# Altium project 08-placa-integradora.PrjPcb
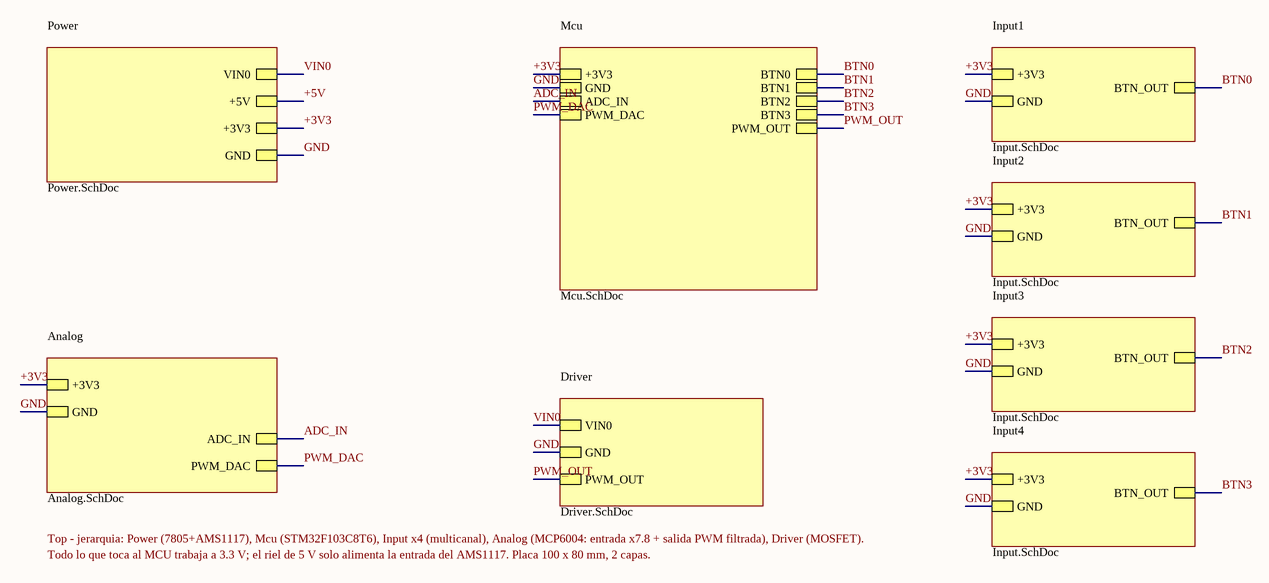
[diagram p0: Top.SchDoc]
6 sheets, 95 parts. Net scope: hierarchical (ports join the sheet entries above them; power ports are global).
Board file: PCB8.PcbDoc
Sheets:
  Top.SchDoc
    Power = Power.SchDoc
    Mcu = Mcu.SchDoc
    Input1 = Input.SchDoc
    Input2 = Input.SchDoc
    Input3 = Input.SchDoc
    Input4 = Input.SchDoc
    Analog = Analog.SchDoc
    Driver = Driver.SchDoc

## Sheet Top.SchDoc: Top: placa de entrenamiento integradora 100 x 80 mm (ejemplo 08)
size A4; Author: Efrain Alvarado; CompanyName: Universidad de Cuenca - MCIE; DrawnBy: Efrain Alvarado; DocumentNumber: E08-T; Revision: 1.0; SheetNumber: 1; SheetTotal: 6

### Sub-sheets
Analog = Analog.SchDoc: +3V3, GND, ADC_IN, PWM_DAC
Driver = Driver.SchDoc: VIN0, GND, PWM_OUT
Input1 = Input.SchDoc: +3V3, GND, BTN_OUT
Input2 = Input.SchDoc: +3V3, GND, BTN_OUT
Input3 = Input.SchDoc: +3V3, GND, BTN_OUT
Input4 = Input.SchDoc: +3V3, GND, BTN_OUT
Mcu = Mcu.SchDoc: +3V3, GND, ADC_IN, PWM_DAC, BTN0, BTN1, BTN2, BTN3, PWM_OUT
Power = Power.SchDoc: VIN0, +5V, +3V3, GND

### Nets
+3V3: sheet Power/+3V3, sheet Mcu/+3V3, sheet Input1/+3V3, sheet Input2/+3V3, sheet Input3/+3V3, sheet Input4/+3V3, sheet Analog/+3V3
ADC_IN: sheet Mcu/ADC_IN, sheet Analog/ADC_IN
BTN0: sheet Mcu/BTN0, sheet Input1/BTN_OUT
BTN1: sheet Mcu/BTN1, sheet Input2/BTN_OUT
BTN2: sheet Mcu/BTN2, sheet Input3/BTN_OUT
BTN3: sheet Mcu/BTN3, sheet Input4/BTN_OUT
GND: sheet Power/GND, sheet Mcu/GND, sheet Input1/GND, sheet Input2/GND, sheet Input3/GND, sheet Input4/GND, sheet Analog/GND, sheet Driver/GND
PWM_DAC: sheet Mcu/PWM_DAC, sheet Analog/PWM_DAC
PWM_OUT: sheet Mcu/PWM_OUT, sheet Driver/PWM_OUT
VIN0: sheet Power/VIN0, sheet Driver/VIN0

### Notes on the sheet
- Top - jerarquia: Power (7805+AMS1117), Mcu (STM32F103C8T6), Input x4 (multicanal), Analog (MCP6004: entrada x7.8 + salida PWM filtrada), Driver (MOSFET).
- Todo lo que toca al MCU trabaja a 3.3 V; el riel de 5 V solo alimenta la entrada del AMS1117. Placa 100 x 80 mm, 2 capas.

## Sheet Power.SchDoc: Power: 7805 + AMS1117-3.3 en cascada (ejemplo 08)
size A4; Author: Efrain Alvarado; CompanyName: Universidad de Cuenca - MCIE; DrawnBy: Efrain Alvarado; DocumentNumber: E08-P; Revision: 1.0; SheetNumber: 1; SheetTotal: 1
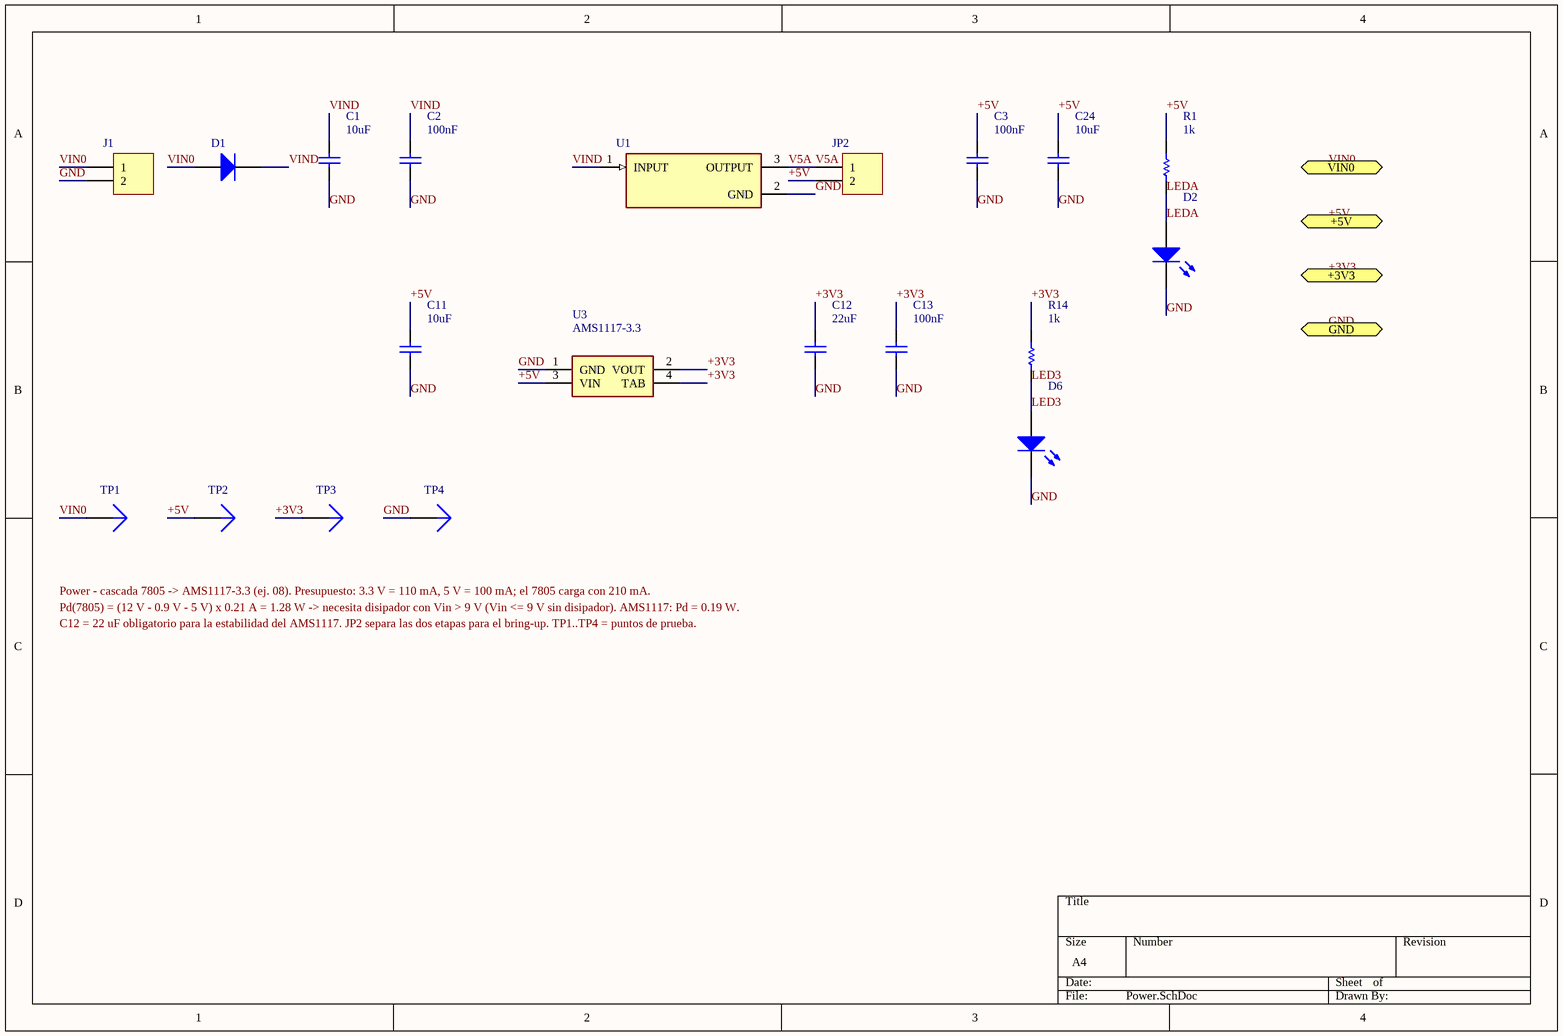
[diagram p1: Power.SchDoc]

### Parts
C1  value 10uF  [C0805]  (hidden comment: Cap)
C2  value 100nF  [0603]  (hidden comment: Cap)
C3  value 100nF  [0603]  (hidden comment: Cap)
C11  value 10uF  [C0805]  (hidden comment: Cap)
C12  value 22uF  [C1206]  (hidden comment: Cap)
C13  value 100nF  [0603]  (hidden comment: Cap)
C24  value 10uF  [C0805]  (hidden comment: Cap)
D1  Diode 1N4007  [DO-41]  (value not drawn)
D2  LED1  [LED-1]  (value not drawn)
D6  LED1  [LED-1]  (value not drawn)
J1  Header 2  [HDR1X2]  (value not drawn)
JP2  Header 2  [HDR1X2]  (value not drawn)
R1  value 1k  [0603]  (hidden comment: Res1)
R14  value 1k  [0603]  (hidden comment: Res1)
TP1  Plug  [PIN1]  (value not drawn)
TP2  Plug  [PIN1]  (value not drawn)
TP3  Plug  [PIN1]  (value not drawn)
TP4  Plug  [PIN1]  (value not drawn)
U1  LM7805T  [TO254P1011X457X1950-3]  (value not drawn)
U3  AMS1117-3.3  [SOT223_N]

### Ports
+3V3, +5V, GND, VIN0

### Nets
+3V3: C12.2 C13.2 R14.2 TP3.1 U3.2(VOUT) U3.4(TAB) ; port +3V3
+5V: C3.2 C11.2 C24.2 JP2.2 R1.2 TP2.1 U3.3(VIN) ; port +5V
GND: C1.1 C2.1 C3.1 C11.1 C12.1 C13.1 C24.1 D2.2(K) D6.2(K) J1.2 TP4.1 U1.2(GND) U3.1(GND) ; port GND
LED3: D6.1(A) R14.1
LEDA: D2.1(A) R1.1
V5A: JP2.1 U1.3(OUTPUT)
VIN0: D1.1(A) J1.1 TP1.1 ; port VIN0
VIND: C1.2 C2.2 D1.2(K) U1.1(INPUT)

### Notes on the sheet
- Power - cascada 7805 -> AMS1117-3.3 (ej. 08). Presupuesto: 3.3 V = 110 mA, 5 V = 100 mA; el 7805 carga con 210 mA.
- Pd(7805) = (12 V - 0.9 V - 5 V) x 0.21 A = 1.28 W -> necesita disipador con Vin > 9 V (Vin <= 9 V sin disipador). AMS1117: Pd = 0.19 W.
- C12 = 22 uF obligatorio para la estabilidad del AMS1117. JP2 separa las dos etapas para el bring-up. TP1..TP4 = puntos de prueba.

### Library data of the parts
C1 C11 C24 = Cap: Capacitor 10uF; Manufacturer: KEMET; Manufacturer Part Number: C0805C10610uF; Published: 8-Jun-2000; LatestRevisionDate: 17-Jul-2002; LatestRevisionNote: Re-released for DXP Platform.; PackageReference: RAD-0.3; Publisher: Altium Limited; PackageDescription: Radial Cap, Thru-Hole; 2 Leads; 0.3 in Pin Spacing
C2 C3 C13 = Cap: Capacitor 100nF; Manufacturer: KEMET; Manufacturer Part Number: C0603C100nF; Published: 8-Jun-2000; LatestRevisionDate: 17-Jul-2002; LatestRevisionNote: Re-released for DXP Platform.; PackageReference: RAD-0.3; Publisher: Altium Limited; PackageDescription: Radial Cap, Thru-Hole; 2 Leads; 0.3 in Pin Spacing
C12 = Cap: Capacitor 22uF; Manufacturer: KEMET; Manufacturer Part Number: C1206C22622uF; Published: 8-Jun-2000; LatestRevisionDate: 17-Jul-2002; LatestRevisionNote: Re-released for DXP Platform.; PackageReference: RAD-0.3; Publisher: Altium Limited; PackageDescription: Radial Cap, Thru-Hole; 2 Leads; 0.3 in Pin Spacing
D1 = Diode 1N4007: Proteccion de polaridad inversa; Manufacturer: Diodes Inc.; Published: 8-Jun-2000; LatestRevisionDate: 17-Jul-2002; LatestRevisionNote: Re-released for DXP Platform.; DatasheetVersion: 1998; PackageVersion: Aug-1999; PackageReference: DO-41; Publisher: Altium Limited; PackageDescription: Diode, Axial; Body 5.2 x 2.7 mm (LxDia. max), Lead Dia. 0.86 mm (max); Code_JEDEC: DO-204-AL; ComponentLink1Description: Manufacturer Link; ComponentLink1URL: http://www.fairchildsemi.com/; ComponentLink2Description: Datasheet; ComponentLink2URL: http://www.fairchildsemi.com/ds/1N%2F1N4001.pdf; Manufacturer Part Number: 1N4007
D2 = LED1: LED de alimentacion (5 V); Manufacturer: Kingbright; Manufacturer Part Number: WP7113ID; Published: 8-Jun-2000; LatestRevisionDate: 08-Jul-2005; LatestRevisionNote: Mech Layer 1 removed.; PackageReference: LED-1; Publisher: Altium Limited; PackageDescription: LED; 2 Leads
D6 = LED1: LED de alimentacion (3.3 V); Manufacturer: Kingbright; Manufacturer Part Number: WP7113GD; Published: 8-Jun-2000; LatestRevisionDate: 08-Jul-2005; LatestRevisionNote: Mech Layer 1 removed.; PackageReference: LED-1; Publisher: Altium Limited; PackageDescription: LED; 2 Leads
J1 = Header 2: Entrada 9-12 V DC: pin1 VIN, pin2 GND; Manufacturer: Generic; Manufacturer Part Number: Pin header 1x2 / borne; LatestRevisionDate: 17-Jul-2002; LatestRevisionNote: Re-released for DXP Platform.; Publisher: Altium Limited
JP2 = Header 2: Jumper de separacion entre etapas; Manufacturer: Generic; Manufacturer Part Number: Pin header 1x2; LatestRevisionDate: 17-Jul-2002; LatestRevisionNote: Re-released for DXP Platform.; Publisher: Altium Limited
R1 R14 = Res1: Resistor 1k 0603; Manufacturer: Yageo; Manufacturer Part Number: RC0603FR-071K; Published: 8-Jun-2000; LatestRevisionDate: 17-Jul-2002; LatestRevisionNote: Re-released for DXP Platform.; PackageReference: AXIAL-0.3; Publisher: Altium Limited; PackageDescription: Axial Device, Thru-Hole; 2 Leads; 0.3 in Pin Spacing
TP1 = Plug: Punto de prueba VIN0; Manufacturer: Generic; Manufacturer Part Number: Test point; LatestRevisionDate: 17-Jul-2002; LatestRevisionNote: Re-released for DXP Platform.; Publisher: Altium Limited
TP2 = Plug: Punto de prueba +5V; Manufacturer: Generic; Manufacturer Part Number: Test point; LatestRevisionDate: 17-Jul-2002; LatestRevisionNote: Re-released for DXP Platform.; Publisher: Altium Limited
TP3 = Plug: Punto de prueba +3V3; Manufacturer: Generic; Manufacturer Part Number: Test point; LatestRevisionDate: 17-Jul-2002; LatestRevisionNote: Re-released for DXP Platform.; Publisher: Altium Limited
TP4 = Plug: Punto de prueba GND; Manufacturer: Generic; Manufacturer Part Number: Test point; LatestRevisionDate: 17-Jul-2002; LatestRevisionNote: Re-released for DXP Platform.; Publisher: Altium Limited
U1 = LM7805T: Regulador 5 V, 1.5 A, TO-220 (necesita disipador si Vin>9 V); Manufacturer: STMicroelectronics; Manufacturer Part Number: L7805CV; MF: TAEJIN; SnapEDA_Link: https://www.snapeda.com/parts/LM7805T/TAEJIN/view-part/?ref=snap; Package: TO-220-3 TAEJIN; Value: *; MP: LM7805T; Check_prices: https://www.snapeda.com/parts/LM7805T/TAEJIN/view-part/?ref=eda
U3 = AMS1117-3.3: LDO 3.3 V 1 A SOT-223; Manufacturer: Advanced Monolithic Systems; Manufacturer Part Number: AMS1117-3.3

## Sheet Mcu.SchDoc: MCU: STM32F103C8T6 + reloj + reset + boot + SWD + UART + I2C + expansion
size A4; Author: Efrain Alvarado; CompanyName: Universidad de Cuenca - MCIE; DrawnBy: Efrain Alvarado; DocumentNumber: E08-M; Revision: 1.0; SheetNumber: 1; SheetTotal: 1
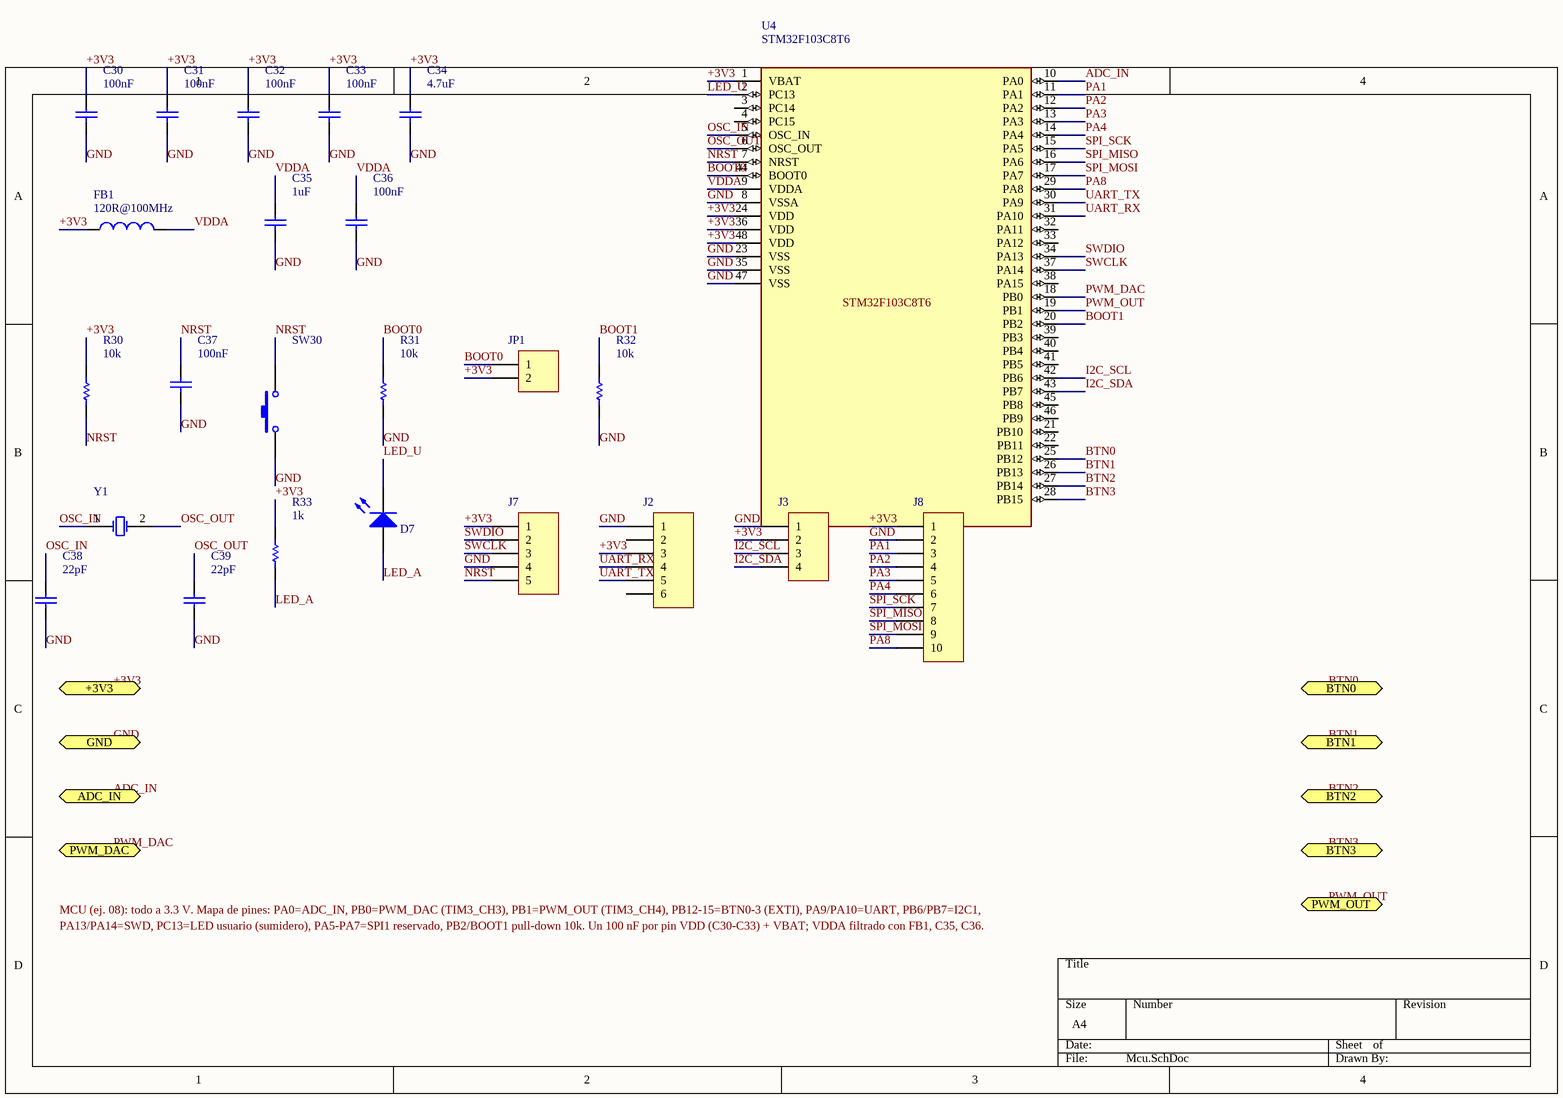
[diagram p2: Mcu.SchDoc]

### Parts
C30  value 100nF  [0603]  (hidden comment: Cap)
C31  value 100nF  [0603]  (hidden comment: Cap)
C32  value 100nF  [0603]  (hidden comment: Cap)
C33  value 100nF  [0603]  (hidden comment: Cap)
C34  value 4.7uF  [C0805]  (hidden comment: Cap)
C35  value 1uF  [0603]  (hidden comment: Cap)
C36  value 100nF  [0603]  (hidden comment: Cap)
C37  value 100nF  [0603]  (hidden comment: Cap)
C38  value 22pF  [0603]  (hidden comment: Cap)
C39  value 22pF  [0603]  (hidden comment: Cap)
D7  LED1  [LED-1]  (value not drawn)
FB1  value 120R@100MHz  [0603]  (hidden comment: Inductor)
J2  Header 6  [HDR1X6]  (value not drawn)
J3  Header 4  [HDR1X4]  (value not drawn)
J7  Header 5  [HDR1X5]  (value not drawn)
J8  Header 10  [HDR1X10]  (value not drawn)
JP1  Header 2  [HDR1X2]  (value not drawn)
R30  value 10k  [0603]  (hidden comment: Res1)
R31  value 10k  [0603]  (hidden comment: Res1)
R32  value 10k  [0603]  (hidden comment: Res1)
R33  value 1k  [0603]  (hidden comment: Res1)
SW30  SW-PB  [SPST-2]  (value not drawn)
U4  STM32F103C8T6  [LQFP48_7x7]
Y1  XTAL  [R38]  (value not drawn)

### Ports
+3V3, ADC_IN, BTN0, BTN1, BTN2, BTN3, GND, PWM_DAC, PWM_OUT

### Nets
+3V3: C30.2 C31.2 C32.2 C33.2 C34.2 FB1.1 J2.3 J3.2 J7.1 J8.1 JP1.2 R30.2 R33.2 U4.1(VBAT) U4.24(VDD) U4.36(VDD) U4.48(VDD) ; port +3V3
ADC_IN: U4.10(PA0) ; port ADC_IN
BOOT0: JP1.1 R31.2 U4.44(BOOT0)
BOOT1: R32.2 U4.20(PB2)
BTN0: U4.25(PB12) ; port BTN0
BTN1: U4.26(PB13) ; port BTN1
BTN2: U4.27(PB14) ; port BTN2
BTN3: U4.28(PB15) ; port BTN3
GND: C30.1 C31.1 C32.1 C33.1 C34.1 C35.1 C36.1 C37.1 C38.1 C39.1 J2.1 J3.1 J7.4 J8.2 R31.1 R32.1 SW30.1 U4.8(VSSA) U4.23(VSS) U4.35(VSS) U4.47(VSS) ; port GND
I2C_SCL: J3.3 U4.42(PB6)
I2C_SDA: J3.4 U4.43(PB7)
LED_A: D7.1(A) R33.1
LED_U: D7.2(K) U4.2(PC13)
NRST: C37.2 J7.5 R30.1 SW30.2 U4.7(NRST)
OSC_IN: C38.2 U4.5(OSC_IN) Y1.1(OSC1)
OSC_OUT: C39.2 U4.6(OSC_OUT) Y1.2(OSC2)
PA1: J8.3 U4.11(PA1)
PA2: J8.4 U4.12(PA2)
PA3: J8.5 U4.13(PA3)
PA4: J8.6 U4.14(PA4)
PA8: J8.10 U4.29(PA8)
PWM_DAC: U4.18(PB0) ; port PWM_DAC
PWM_OUT: U4.19(PB1) ; port PWM_OUT
SPI_MISO: J8.8 U4.16(PA6)
SPI_MOSI: J8.9 U4.17(PA7)
SPI_SCK: J8.7 U4.15(PA5)
SWCLK: J7.3 U4.37(PA14)
SWDIO: J7.2 U4.34(PA13)
UART_RX: J2.4 U4.31(PA10)
UART_TX: J2.5 U4.30(PA9)
VDDA: C35.2 C36.2 FB1.2 U4.9(VDDA)

Not connected (* = marked no-connect by the designer): J2 2 6; U4 3(PC14) 4(PC15) 21(PB10) 22(PB11) 32(PA11) 33(PA12) 38(PA15) 39(PB3) 40(PB4) 41(PB5) 45(PB8) 46(PB9)

### Notes on the sheet
- MCU (ej. 08): todo a 3.3 V. Mapa de pines: PA0=ADC_IN, PB0=PWM_DAC (TIM3_CH3), PB1=PWM_OUT (TIM3_CH4), PB12-15=BTN0-3 (EXTI), PA9/PA10=UART, PB6/PB7=I2C1,
- PA13/PA14=SWD, PC13=LED usuario (sumidero), PA5-PA7=SPI1 reservado, PB2/BOOT1 pull-down 10k. Un 100 nF por pin VDD (C30-C33) + VBAT; VDDA filtrado con FB1, C35, C36.

### Library data of the parts
C30-C33 C36 C37 = Cap: as C2 on sheet Power; Published: 8-Jun-2000; LatestRevisionDate: 17-Jul-2002; LatestRevisionNote: Re-released for DXP Platform.; PackageReference: RAD-0.3; Publisher: Altium Limited; PackageDescription: Radial Cap, Thru-Hole; 2 Leads; 0.3 in Pin Spacing
C34 = Cap: Capacitor 4.7uF; Manufacturer: KEMET; Manufacturer Part Number: C0805C4754.7uF; Published: 8-Jun-2000; LatestRevisionDate: 17-Jul-2002; LatestRevisionNote: Re-released for DXP Platform.; PackageReference: RAD-0.3; Publisher: Altium Limited; PackageDescription: Radial Cap, Thru-Hole; 2 Leads; 0.3 in Pin Spacing
C35 = Cap: Capacitor 1uF; Manufacturer: KEMET; Manufacturer Part Number: C0603C1051uF; Published: 8-Jun-2000; LatestRevisionDate: 17-Jul-2002; LatestRevisionNote: Re-released for DXP Platform.; PackageReference: RAD-0.3; Publisher: Altium Limited; PackageDescription: Radial Cap, Thru-Hole; 2 Leads; 0.3 in Pin Spacing
C38 C39 = Cap: Capacitor 22pF; Manufacturer: KEMET; Manufacturer Part Number: C0603C22022pF; Published: 8-Jun-2000; LatestRevisionDate: 17-Jul-2002; LatestRevisionNote: Re-released for DXP Platform.; PackageReference: RAD-0.3; Publisher: Altium Limited; PackageDescription: Radial Cap, Thru-Hole; 2 Leads; 0.3 in Pin Spacing
D7 = LED1: LED de usuario (PC13 sumidero); Manufacturer: Kingbright; Manufacturer Part Number: WP7113ID; Published: 8-Jun-2000; LatestRevisionDate: 08-Jul-2005; LatestRevisionNote: Mech Layer 1 removed.; PackageReference: LED-1; Publisher: Altium Limited; PackageDescription: LED; 2 Leads
FB1 = Inductor: Ferrite bead VDD -> VDDA; Manufacturer: Murata; Manufacturer Part Number: BLM18PG121SN1D; Code_IEC: 1005; Published: 8-Jun-2000; LatestRevisionDate: 29-May-2009; LatestRevisionNote: IPC-7351 Footprint Added.; PackageReference: 0402-A; Publisher: Altium Limited; PackageDescription: Chip Inductor; Code_JEITA: 0402
J2 = Header 6: UART FTDI: GND, -, 3V3, RX, TX, -; Manufacturer: Generic; Manufacturer Part Number: Pin header 1x6 FTDI; LatestRevisionDate: 17-Jul-2002; LatestRevisionNote: Re-released for DXP Platform.; Publisher: Altium Limited
J3 = Header 4: I2C: GND, 3V3, SCL, SDA; Manufacturer: Generic; Manufacturer Part Number: Pin header 1x4; LatestRevisionDate: 17-Jul-2002; LatestRevisionNote: Re-released for DXP Platform.; Publisher: Altium Limited
J7 = Header 5: SWD: 3V3, SWDIO, SWCLK, GND, NRST; Manufacturer: Generic; Manufacturer Part Number: Pin header 1x5; LatestRevisionDate: 17-Jul-2002; LatestRevisionNote: Re-released for DXP Platform.; Publisher: Altium Limited
J8 = Header 10: Expansion: 3V3, GND, PA1-PA4, SPI SCK/MISO/MOSI, PA8; Manufacturer: Generic; Manufacturer Part Number: Pin header 1x10; LatestRevisionDate: 17-Jul-2002; LatestRevisionNote: Re-released for DXP Platform.; Publisher: Altium Limited
JP1 = Header 2: Jumper BOOT0: cerrado = bootloader UART; Manufacturer: Generic; Manufacturer Part Number: Pin header 1x2; LatestRevisionDate: 17-Jul-2002; LatestRevisionNote: Re-released for DXP Platform.; Publisher: Altium Limited
R30-R32 = Res1: Resistor 10k 0603; Manufacturer: Yageo; Manufacturer Part Number: RC0603FR-0710K; Published: 8-Jun-2000; LatestRevisionDate: 17-Jul-2002; LatestRevisionNote: Re-released for DXP Platform.; PackageReference: AXIAL-0.3; Publisher: Altium Limited; PackageDescription: Axial Device, Thru-Hole; 2 Leads; 0.3 in Pin Spacing
R33 = Res1: as R1 on sheet Power; Published: 8-Jun-2000; LatestRevisionDate: 17-Jul-2002; LatestRevisionNote: Re-released for DXP Platform.; PackageReference: AXIAL-0.3; Publisher: Altium Limited; PackageDescription: Axial Device, Thru-Hole; 2 Leads; 0.3 in Pin Spacing
SW30 = SW-PB: Reset manual; Manufacturer: Generic; Manufacturer Part Number: Tactile 6x6; Published: 24-Mar-1999; LatestRevisionDate: 17-Jul-2002; LatestRevisionNote: Re-released for DXP Platform.; PackageReference: SPST-2; Publisher: Altium Limited; PackageDescription: Switch; 2 Leads
U4 = STM32F103C8T6: STM32F103C8T6 ARM Cortex-M3 72 MHz LQFP48; Manufacturer: STMicroelectronics; Manufacturer Part Number: STM32F103C8T6
Y1 = XTAL: Cristal 8 MHz CL=20 pF; Manufacturer: Abracon; Manufacturer Part Number: ABL-8.000MHZ-B2; Published: 8-Jun-2000; LatestRevisionDate: 17-Jul-2002; LatestRevisionNote: Re-released for DXP Platform.; PackageReference: R38; Publisher: Altium Limited; PackageDescription: Crystal, Thru-Hole; 2 Leads; Body 3.1 x 8.2 mm (Dia.xH)

## Sheet Input.SchDoc: Input: canal antirrebote 74HC14 a 3.3 V (se instancia x4)
size A4; Author: Efrain Alvarado; CompanyName: Universidad de Cuenca - MCIE; DrawnBy: Efrain Alvarado; DocumentNumber: E08-I; Revision: 1.0; SheetNumber: 1; SheetTotal: 1
Used 4 times, as channels Input1, Input2, Input3, Input4. Parts and nets are listed once, with the designators drawn on the sheet.
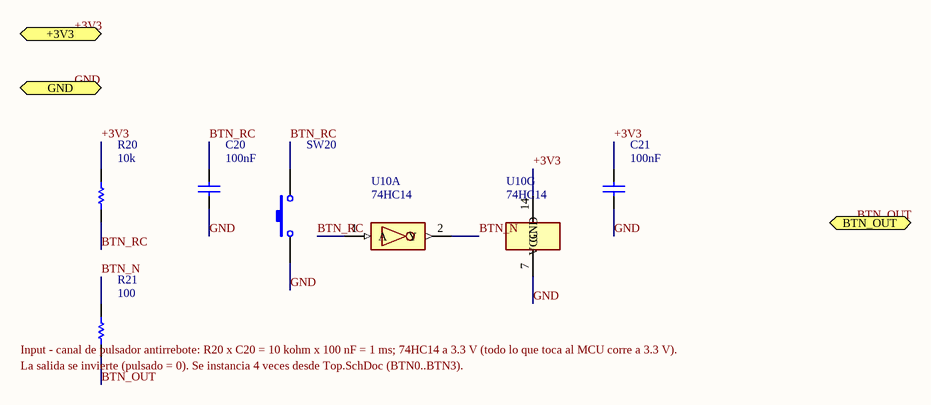
[diagram p3: Input.SchDoc]

### Parts
C20  value 100nF  [0603]  (hidden comment: Cap)
C21  value 100nF  [0603]  (hidden comment: Cap)
R20  value 10k  [0603]  (hidden comment: Res1)
R21  value 100  [0603]  (hidden comment: Res1)
SW20  SW-PB  [SPST-2]  (value not drawn)
U10  74HC14  [DIP-14]  (parts A,G of 7)

### Ports
+3V3, BTN_OUT, GND

### Nets
+3V3: C21.2 R20.2 U10.14(VCC) ; port +3V3
BTN_N: R21.2 U10.2(Y)
BTN_OUT: R21.1 ; port BTN_OUT
BTN_RC: C20.2 R20.1 SW20.2 U10.1(A)
GND: C20.1 C21.1 SW20.1 U10.7(GND) ; port GND

### Channels
Input1: designators end in _Input1; ports +3V3=+3V3 BTN_OUT=BTN0 GND=GND
Input2: designators end in _Input2; ports +3V3=+3V3 BTN_OUT=BTN1 GND=GND
Input3: designators end in _Input3; ports +3V3=+3V3 BTN_OUT=BTN2 GND=GND
Input4: designators end in _Input4; ports +3V3=+3V3 BTN_OUT=BTN3 GND=GND

### Notes on the sheet
- (near R21) Input - canal de pulsador antirrebote: R20 x C20 = 10 kohm x 100 nF = 1 ms; 74HC14 a 3.3 V (todo lo que toca al MCU corre a 3.3 V).
- (near R21) La salida se invierte (pulsado = 0). Se instancia 4 veces desde Top.SchDoc (BTN0..BTN3).

### Library data of the parts
C20 C21 = Cap: as C2 on sheet Power; Published: 8-Jun-2000; LatestRevisionDate: 17-Jul-2002; LatestRevisionNote: Re-released for DXP Platform.; PackageReference: RAD-0.3; Publisher: Altium Limited; PackageDescription: Radial Cap, Thru-Hole; 2 Leads; 0.3 in Pin Spacing
R20 = Res1: as R30 on sheet Mcu; Published: 8-Jun-2000; LatestRevisionDate: 17-Jul-2002; LatestRevisionNote: Re-released for DXP Platform.; PackageReference: AXIAL-0.3; Publisher: Altium Limited; PackageDescription: Axial Device, Thru-Hole; 2 Leads; 0.3 in Pin Spacing
R21 = Res1: Resistor 100 0603; Manufacturer: Yageo; Manufacturer Part Number: RC0603FR-07100; Published: 8-Jun-2000; LatestRevisionDate: 17-Jul-2002; LatestRevisionNote: Re-released for DXP Platform.; PackageReference: AXIAL-0.3; Publisher: Altium Limited; PackageDescription: Axial Device, Thru-Hole; 2 Leads; 0.3 in Pin Spacing
SW20 = SW-PB: Pulsador NA; Manufacturer: Generic; Manufacturer Part Number: Tactile 6x6; Published: 24-Mar-1999; LatestRevisionDate: 17-Jul-2002; LatestRevisionNote: Re-released for DXP Platform.; PackageReference: SPST-2; Publisher: Altium Limited; PackageDescription: Switch; 2 Leads
U10 = 74HC14: Hex Schmitt-trigger inverter 6 gates (A-F) + power part G (VCC=14, GND=7); Manufacturer: Texas Instruments; Manufacturer Part Number: SN74HC14N

## Sheet Analog.SchDoc: Analog: entrada x7.8 (PA0) + salida PWM filtrada (PB0), MCP6004 a 3.3 V
size A4; Author: Efrain Alvarado; CompanyName: Universidad de Cuenca - MCIE; DrawnBy: Efrain Alvarado; DocumentNumber: E08-A; Revision: 1.0; SheetNumber: 1; SheetTotal: 1
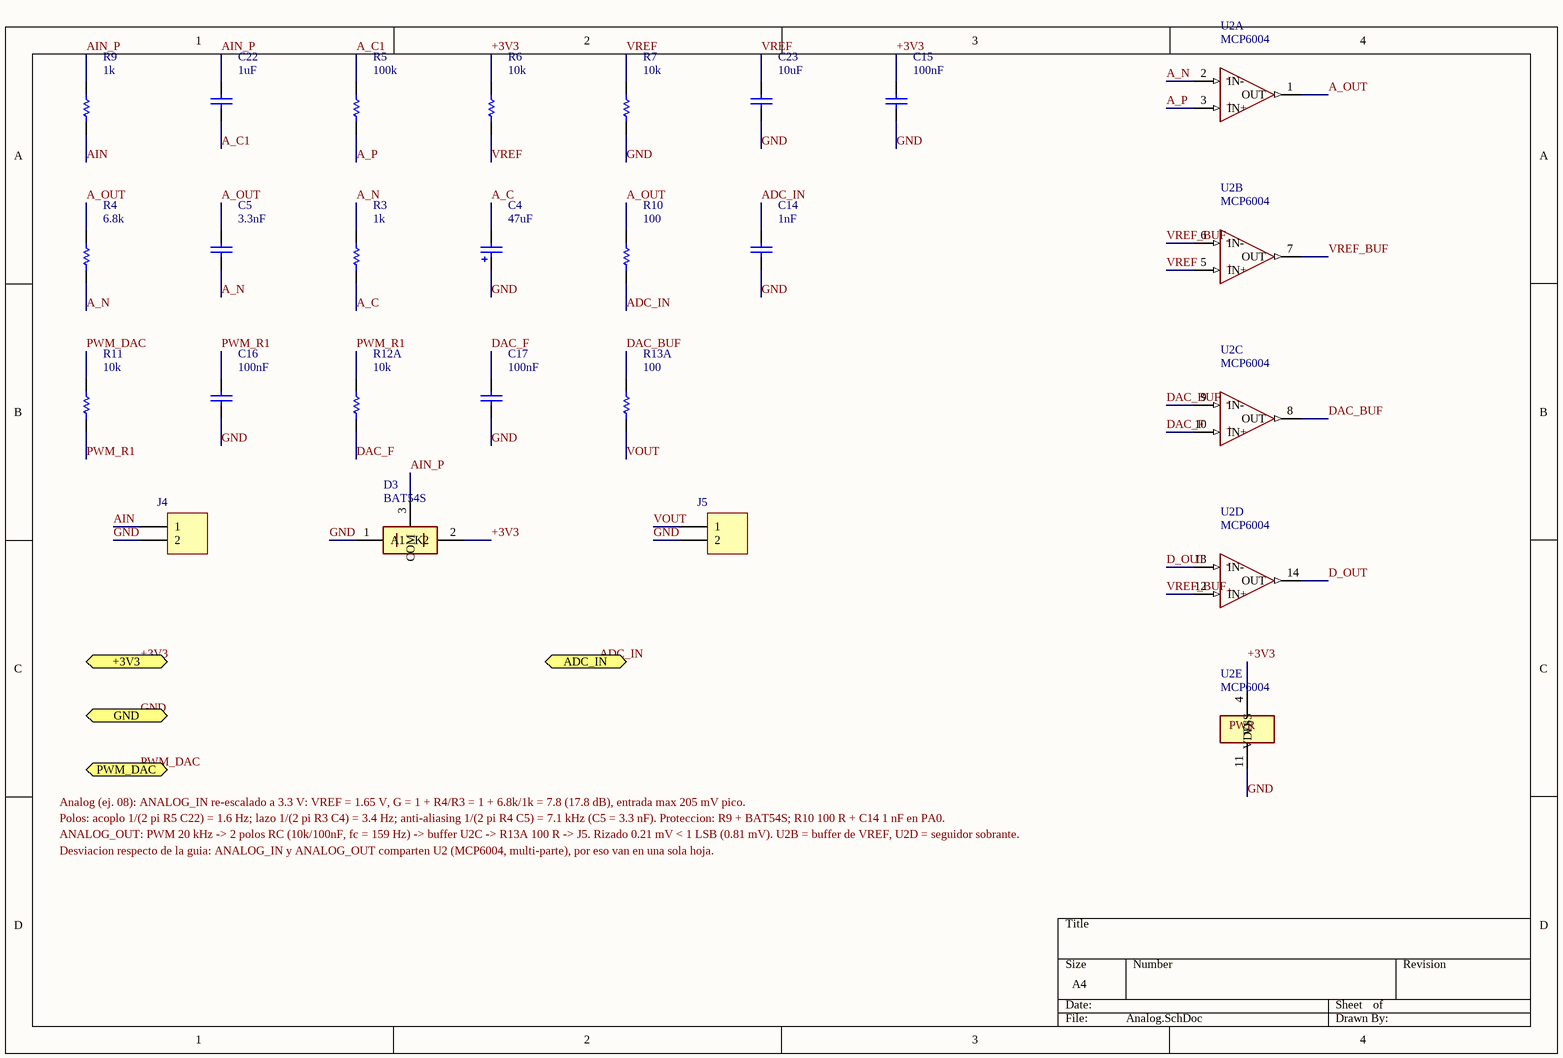
[diagram p4: Analog.SchDoc]

### Parts
C4  value 47uF  [RB5-10.5]  (hidden comment: Cap Pol1)
C5  value 3.3nF  [0603]  (hidden comment: Cap)
C14  value 1nF  [0603]  (hidden comment: Cap)
C15  value 100nF  [0603]  (hidden comment: Cap)
C16  value 100nF  [0603]  (hidden comment: Cap)
C17  value 100nF  [0603]  (hidden comment: Cap)
C22  value 1uF  [0603]  (hidden comment: Cap)
C23  value 10uF  [C0805]  (hidden comment: Cap)
D3  BAT54S  [SOT-23_N]
J4  Header 2  [HDR1X2]  (value not drawn)
J5  Header 2  [HDR1X2]  (value not drawn)
R3  value 1k  [0603]  (hidden comment: Res1)
R4  value 6.8k  [0603]  (hidden comment: Res1)
R5  value 100k  [0603]  (hidden comment: Res1)
R6  value 10k  [0603]  (hidden comment: Res1)
R7  value 10k  [0603]  (hidden comment: Res1)
R9  value 1k  [0603]  (hidden comment: Res1)
R10  value 100  [0603]  (hidden comment: Res1)
R11  value 10k  [0603]  (hidden comment: Res1)
R12A  value 10k  [0603]  (hidden comment: Res1)
R13A  value 100  [0603]  (hidden comment: Res1)
U2  MCP6004  [DIP-14]  (parts A,B,C,D,E of 5)

### Ports
+3V3, ADC_IN, GND, PWM_DAC

### Nets
+3V3: C15.2 D3.2(K2) R6.2 U2.4(VDD) ; port +3V3
A_C: C4.2 R3.1
A_C1: C22.1 R5.2
A_N: C5.1 R3.2 R4.1 U2.2(IN-)
A_OUT: C5.2 R4.2 R10.2 U2.1(OUT)
A_P: R5.1 U2.3(IN+)
ADC_IN: C14.2 R10.1 ; port ADC_IN
AIN: J4.1 R9.1
AIN_P: C22.2 D3.3(COM) R9.2
D_OUT: U2.13(IN-) U2.14(OUT)
DAC_BUF: R13A.2 U2.8(OUT) U2.9(IN-)
DAC_F: C17.2 R12A.1 U2.10(IN+)
GND: C4.1 C14.1 C15.1 C16.1 C17.1 C23.1 D3.1(A1) J4.2 J5.2 R7.1 U2.11(VSS) ; port GND
PWM_DAC: R11.2 ; port PWM_DAC
PWM_R1: C16.2 R11.1 R12A.2
VOUT: J5.1 R13A.1
VREF: C23.2 R6.1 R7.2 U2.5(IN+)
VREF_BUF: U2.6(IN-) U2.7(OUT) U2.12(IN+)

### Notes on the sheet
- Analog (ej. 08): ANALOG_IN re-escalado a 3.3 V: VREF = 1.65 V, G = 1 + R4/R3 = 1 + 6.8k/1k = 7.8 (17.8 dB), entrada max 205 mV pico.
- Polos: acoplo 1/(2 pi R5 C22) = 1.6 Hz; lazo 1/(2 pi R3 C4) = 3.4 Hz; anti-aliasing 1/(2 pi R4 C5) = 7.1 kHz (C5 = 3.3 nF). Proteccion: R9 + BAT54S; R10 100 R + C14 1 nF en PA0.
- ANALOG_OUT: PWM 20 kHz -> 2 polos RC (10k/100nF, fc = 159 Hz) -> buffer U2C -> R13A 100 R -> J5. Rizado 0.21 mV < 1 LSB (0.81 mV). U2B = buffer de VREF, U2D = seguidor sobrante.
- Desviacion respecto de la guia: ANALOG_IN y ANALOG_OUT comparten U2 (MCP6004, multi-parte), por eso van en una sola hoja.
- (in symbol MCP6004, part A) -; +
- (in symbol MCP6004, part B) -; +
- (in symbol MCP6004, part C) -; +
- (in symbol MCP6004, part D) -; +
- (in symbol MCP6004, part E) PWR

### Library data of the parts
C4 = Cap Pol1: Electrolitico 47 uF 16 V (polo del lazo 3.4 Hz); Manufacturer: Panasonic; Manufacturer Part Number: EEU-FR1C470; Published: 8-Jun-2000; LatestRevisionDate: 17-Jul-2002; LatestRevisionNote: Re-released for DXP Platform.; PackageReference: RB7.6-15; Publisher: Altium Limited; PackageDescription: Polarized Capacitor (Radial); 2 Leads
C5 = Cap: Capacitor 3.3nF; Manufacturer: KEMET; Manufacturer Part Number: C0603C3323.3nF; Published: 8-Jun-2000; LatestRevisionDate: 17-Jul-2002; LatestRevisionNote: Re-released for DXP Platform.; PackageReference: RAD-0.3; Publisher: Altium Limited; PackageDescription: Radial Cap, Thru-Hole; 2 Leads; 0.3 in Pin Spacing
C14 = Cap: Capacitor 1nF; Manufacturer: KEMET; Manufacturer Part Number: C0603C1021nF; Published: 8-Jun-2000; LatestRevisionDate: 17-Jul-2002; LatestRevisionNote: Re-released for DXP Platform.; PackageReference: RAD-0.3; Publisher: Altium Limited; PackageDescription: Radial Cap, Thru-Hole; 2 Leads; 0.3 in Pin Spacing
C15-C17 = Cap: as C2 on sheet Power; Published: 8-Jun-2000; LatestRevisionDate: 17-Jul-2002; LatestRevisionNote: Re-released for DXP Platform.; PackageReference: RAD-0.3; Publisher: Altium Limited; PackageDescription: Radial Cap, Thru-Hole; 2 Leads; 0.3 in Pin Spacing
C22 = Cap: as C35 on sheet Mcu; Published: 8-Jun-2000; LatestRevisionDate: 17-Jul-2002; LatestRevisionNote: Re-released for DXP Platform.; PackageReference: RAD-0.3; Publisher: Altium Limited; PackageDescription: Radial Cap, Thru-Hole; 2 Leads; 0.3 in Pin Spacing
C23 = Cap: as C1 on sheet Power; Published: 8-Jun-2000; LatestRevisionDate: 17-Jul-2002; LatestRevisionNote: Re-released for DXP Platform.; PackageReference: RAD-0.3; Publisher: Altium Limited; PackageDescription: Radial Cap, Thru-Hole; 2 Leads; 0.3 in Pin Spacing
D3 = BAT54S: Dual Schottky series pair SOT-23 (clamp); Manufacturer: Nexperia; Manufacturer Part Number: BAT54S
J4 = Header 2: Entrada analogica +-200 mV: pin1 senal, pin2 GND; Manufacturer: Generic; Manufacturer Part Number: Pin header 1x2; LatestRevisionDate: 17-Jul-2002; LatestRevisionNote: Re-released for DXP Platform.; Publisher: Altium Limited
J5 = Header 2: Salida analogica 0-3.3 V: pin1 VOUT, pin2 GND; Manufacturer: Generic; Manufacturer Part Number: Pin header 1x2; LatestRevisionDate: 17-Jul-2002; LatestRevisionNote: Re-released for DXP Platform.; Publisher: Altium Limited
R3 R9 = Res1: as R1 on sheet Power; Published: 8-Jun-2000; LatestRevisionDate: 17-Jul-2002; LatestRevisionNote: Re-released for DXP Platform.; PackageReference: AXIAL-0.3; Publisher: Altium Limited; PackageDescription: Axial Device, Thru-Hole; 2 Leads; 0.3 in Pin Spacing
R4 = Res1: Resistor 6.8k 0603; Manufacturer: Yageo; Manufacturer Part Number: RC0603FR-076.8K; Published: 8-Jun-2000; LatestRevisionDate: 17-Jul-2002; LatestRevisionNote: Re-released for DXP Platform.; PackageReference: AXIAL-0.3; Publisher: Altium Limited; PackageDescription: Axial Device, Thru-Hole; 2 Leads; 0.3 in Pin Spacing
R5 = Res1: Resistor 100k 0603; Manufacturer: Yageo; Manufacturer Part Number: RC0603FR-07100K; Published: 8-Jun-2000; LatestRevisionDate: 17-Jul-2002; LatestRevisionNote: Re-released for DXP Platform.; PackageReference: AXIAL-0.3; Publisher: Altium Limited; PackageDescription: Axial Device, Thru-Hole; 2 Leads; 0.3 in Pin Spacing
R6 R7 R11 R12A = Res1: as R30 on sheet Mcu; Published: 8-Jun-2000; LatestRevisionDate: 17-Jul-2002; LatestRevisionNote: Re-released for DXP Platform.; PackageReference: AXIAL-0.3; Publisher: Altium Limited; PackageDescription: Axial Device, Thru-Hole; 2 Leads; 0.3 in Pin Spacing
R10 R13A = Res1: as R21 on sheet Input; Published: 8-Jun-2000; LatestRevisionDate: 17-Jul-2002; LatestRevisionNote: Re-released for DXP Platform.; PackageReference: AXIAL-0.3; Publisher: Altium Limited; PackageDescription: Axial Device, Thru-Hole; 2 Leads; 0.3 in Pin Spacing
U2 = MCP6004: MCP6004 quad op-amp rail-to-rail 1 MHz (A-D) + power part E, PDIP-14; Manufacturer: Microchip; Manufacturer Part Number: MCP6004-I/P

## Sheet Driver.SchDoc: Driver: MOSFET logic-level low-side con diodo de rueda libre
size A4; Author: Efrain Alvarado; CompanyName: Universidad de Cuenca - MCIE; DrawnBy: Efrain Alvarado; DocumentNumber: E08-D; Revision: 1.0; SheetNumber: 1; SheetTotal: 1
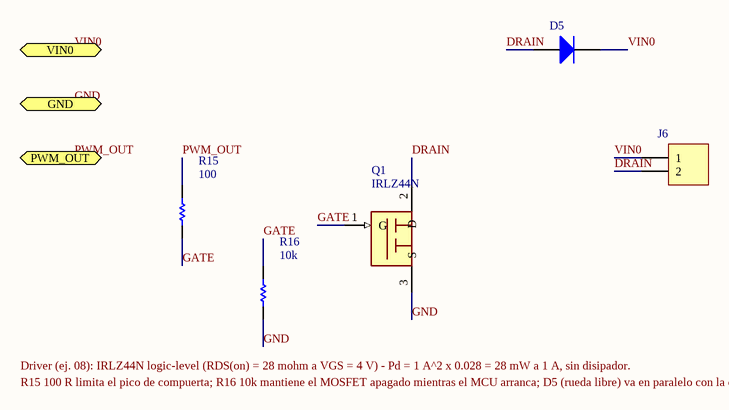
[diagram p5: Driver.SchDoc]

### Parts
D5  Diode 1N4007  [DO-41]  (value not drawn)
J6  Header 2  [HDR1X2]  (value not drawn)
Q1  IRLZ44N  [TO-220AB]
R15  value 100  [0603]  (hidden comment: Res1)
R16  value 10k  [0603]  (hidden comment: Res1)

### Ports
GND, PWM_OUT, VIN0

### Nets
DRAIN: D5.1(A) J6.2 Q1.2(D)
GATE: Q1.1(G) R15.1 R16.2
GND: Q1.3(S) R16.1 ; port GND
PWM_OUT: R15.2 ; port PWM_OUT
VIN0: D5.2(K) J6.1 ; port VIN0

### Notes on the sheet
- Driver (ej. 08): IRLZ44N logic-level (RDS(on) = 28 mohm a VGS = 4 V) - Pd = 1 A^2 x 0.028 = 28 mW a 1 A, sin disipador.
- R15 100 R limita el pico de compuerta; R16 10k mantiene el MOSFET apagado mientras el MCU arranca; D5 (rueda libre) va en paralelo con la carga.

### Library data of the parts
D5 = Diode 1N4007: Rueda libre en paralelo con la carga; Manufacturer: Diodes Inc.; Published: 8-Jun-2000; LatestRevisionDate: 17-Jul-2002; LatestRevisionNote: Re-released for DXP Platform.; DatasheetVersion: 1998; PackageVersion: Aug-1999; PackageReference: DO-41; Publisher: Altium Limited; PackageDescription: Diode, Axial; Body 5.2 x 2.7 mm (LxDia. max), Lead Dia. 0.86 mm (max); Code_JEDEC: DO-204-AL; ComponentLink1Description: Manufacturer Link; ComponentLink1URL: http://www.fairchildsemi.com/; ComponentLink2Description: Datasheet; ComponentLink2URL: http://www.fairchildsemi.com/ds/1N%2F1N4001.pdf; Manufacturer Part Number: 1N4007
J6 = Header 2: Carga externa: pin1 VIN, pin2 DRAIN; Manufacturer: Generic; Manufacturer Part Number: Pin header 1x2 / borne; LatestRevisionDate: 17-Jul-2002; LatestRevisionNote: Re-released for DXP Platform.; Publisher: Altium Limited
Q1 = IRLZ44N: N-MOSFET logic-level 55 V 47 A TO-220 (G,D,S); Manufacturer: Infineon; Manufacturer Part Number: IRLZ44NPBF
R15 = Res1: as R21 on sheet Input; Published: 8-Jun-2000; LatestRevisionDate: 17-Jul-2002; LatestRevisionNote: Re-released for DXP Platform.; PackageReference: AXIAL-0.3; Publisher: Altium Limited; PackageDescription: Axial Device, Thru-Hole; 2 Leads; 0.3 in Pin Spacing
R16 = Res1: as R30 on sheet Mcu; Published: 8-Jun-2000; LatestRevisionDate: 17-Jul-2002; LatestRevisionNote: Re-released for DXP Platform.; PackageReference: AXIAL-0.3; Publisher: Altium Limited; PackageDescription: Axial Device, Thru-Hole; 2 Leads; 0.3 in Pin Spacing

## Nets that join several sheets
+3V3: Power (6 pins), Mcu (17 pins), Input1 (C21_Input1.2 R20_Input1.2 U10_Input1.14), Input2 (C21_Input2.2 R20_Input2.2 U10_Input2.14), Input3 (C21_Input3.2 R20_Input3.2 U10_Input3.14), Input4 (C21_Input4.2 R20_Input4.2 U10_Input4.14), Analog (C15.2 D3.2 R6.2 U2.4)
ADC_IN: Mcu (U4.10), Analog (C14.2 R10.1)
BTN0: Mcu (U4.25), Input1 (R21_Input1.1)
BTN1: Mcu (U4.26), Input2 (R21_Input2.1)
BTN2: Mcu (U4.27), Input3 (R21_Input3.1)
BTN3: Mcu (U4.28), Input4 (R21_Input4.1)
GND: Power (13 pins), Mcu (21 pins), Input1 (C20_Input1.1 C21_Input1.1 SW20_Input1.1 U10_Input1.7), Input2 (C20_Input2.1 C21_Input2.1 SW20_Input2.1 U10_Input2.7), Input3 (C20_Input3.1 C21_Input3.1 SW20_Input3.1 U10_Input3.7), Input4 (C20_Input4.1 C21_Input4.1 SW20_Input4.1 U10_Input4.7), Analog (11 pins), Driver (Q1.3 R16.1)
PWM_DAC: Mcu (U4.18), Analog (R11.2)
PWM_OUT: Mcu (U4.19), Driver (R15.2)
VIN0: Power (D1.1 J1.1 TP1.1), Driver (D5.2 J6.1)